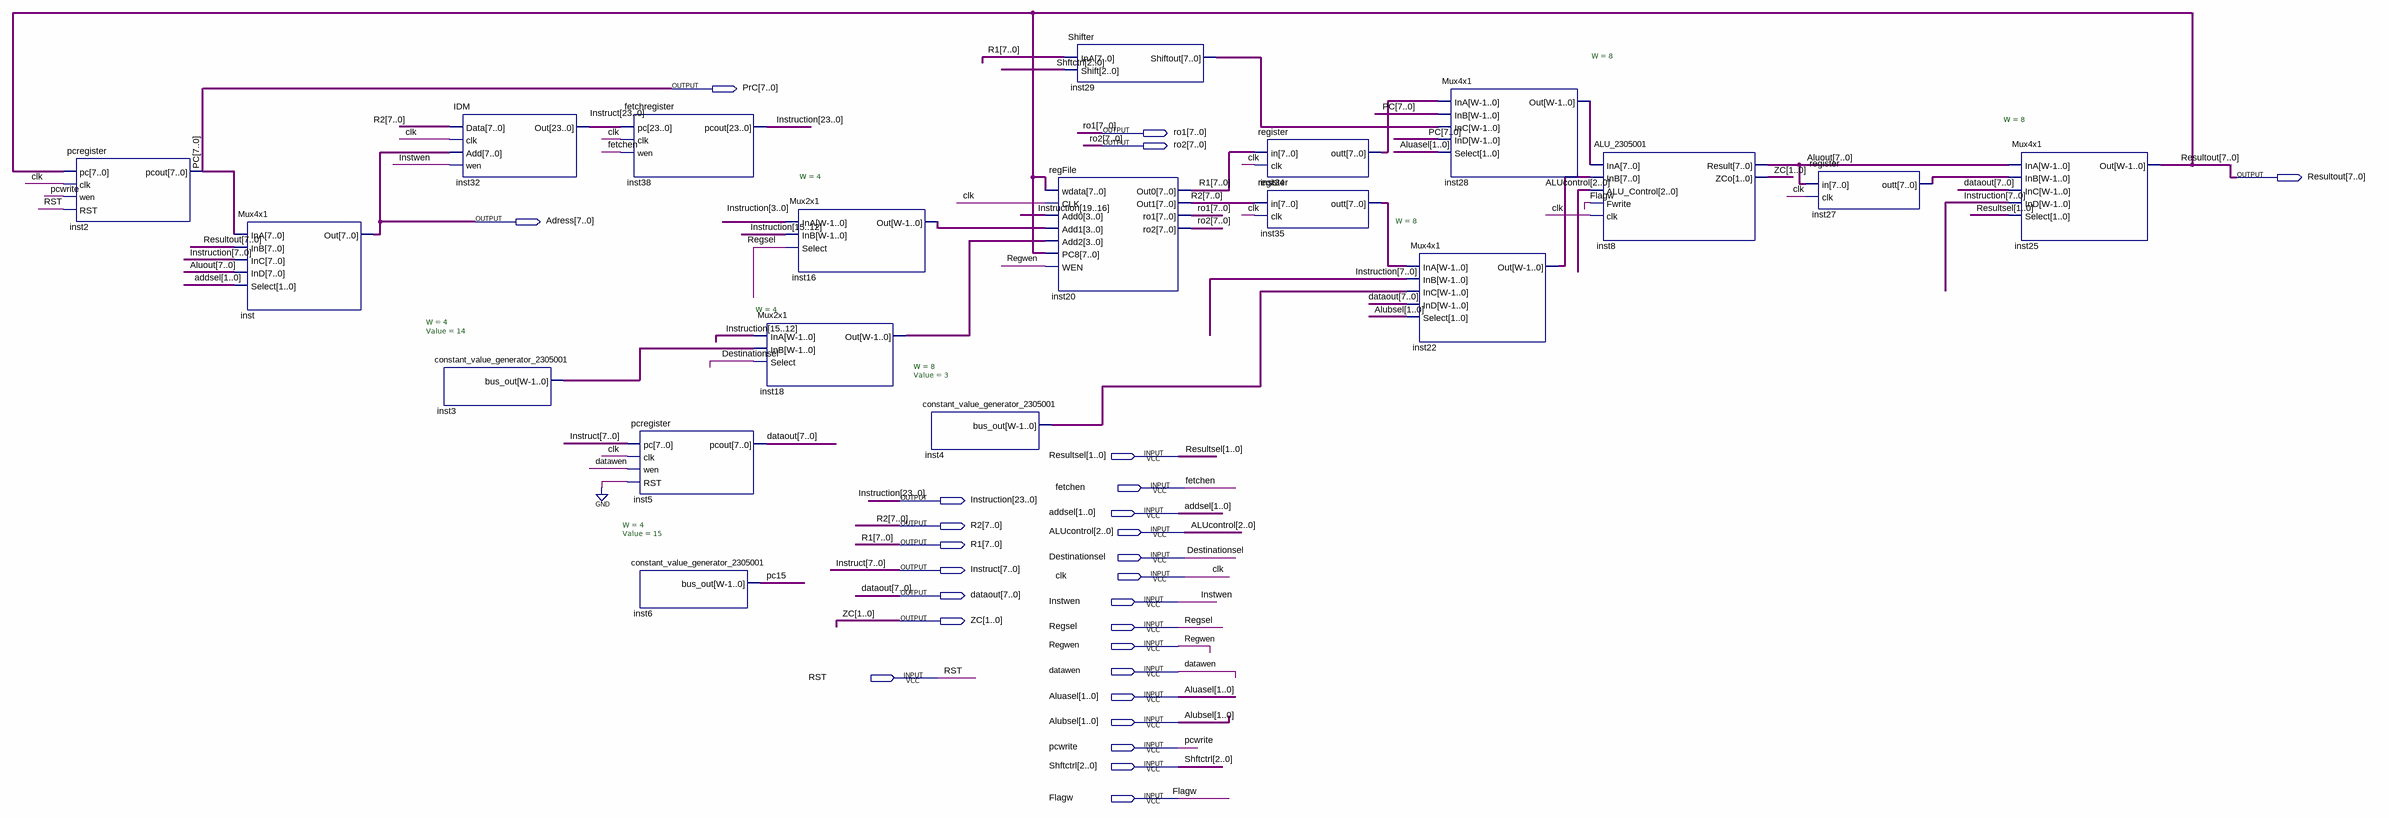
[diagram p0: schematic sheet]
// Quartus schematic Datapath.bdf as structural Verilog: 19 symbols, 27 pins
module Datapath (
  input  [1:0] Resultsel,
  input  fetchen,
  input  [1:0] addsel,
  input  [2:0] ALUcontrol,
  input  Destinationsel,
  input  clk,
  input  Instwen,
  input  Regsel,
  input  Regwen,
  input  datawen,
  input  RST,
  input  [1:0] Aluasel,
  input  [1:0] Alubsel,
  input  pcwrite,
  input  [2:0] Shftctrl,
  input  Flagw,
  output [7:0] PrC,
  output [7:0] ro1,
  output [7:0] ro2,
  output [7:0] Resultout,
  output [7:0] Adress,
  output [23:0] Instruction,
  output [7:0] R2,
  output [7:0] R1,
  output [23:0] Instruct,
  output [7:0] dataout,
  output [1:0] ZC
);

  wire pc15;
  wire [3:0] inst3_bus_out, inst16_out, inst18_out;
  wire [7:0] Aluout, inst4_bus_out, inst22_out, inst27_outt, inst28_out, inst29_shiftout, inst34_outt,
       inst35_outt;

  pcregister inst2 (.pc(Resultout), .clk(clk), .wen(pcwrite), .RST(RST), .pcout(PrC));
  Mux4x1 inst (.InA(PrC), .InB(Resultout), .InC(Instruction[7:0]), .InD(Aluout), .Select(addsel), .Out(Adress));
  constant_value_generator_2305001 #(.W(4), .Value(14)) inst3 (.bus_out(inst3_bus_out));
  IDM inst32 (.Data(R2), .clk(clk), .Add(Adress), .wen(Instwen), .Out(Instruct));
  fetchregister inst38 (.pc(Instruct), .clk(clk), .wen(fetchen), .pcout(Instruction));
  pcregister inst5 (.pc(Instruct[7:0]), .clk(clk), .wen(datawen), .RST(1'b0), .pcout(dataout));
  constant_value_generator_2305001 #(.W(4), .Value(15)) inst6 (.bus_out(pc15));
  Mux2x1 #(.W(4)) inst16 (.InA(Instruction[3:0]), .InB(Instruction[15:12]), .Select(Regsel), .Out(inst16_out));
  Mux2x1 #(.W(4)) inst18 (.InA(Instruction[15:12]), .InB(inst3_bus_out), .Select(Destinationsel), .Out(inst18_out));
  constant_value_generator_2305001 #(.W(8), .Value(3)) inst4 (.bus_out(inst4_bus_out));
  regFile inst20 (
    .wdata(Resultout), .CLK(clk), .Add0(Instruction[19:16]), .Add1(inst16_out), .Add2(inst18_out),
    .PC8(Resultout), .WEN(Regwen), .Out0(R1), .Out1(R2), .ro1(ro1), .ro2(ro2));
  Shifter inst29 (.InA(R1), .Shift(Shftctrl), .Shiftout(inst29_shiftout));
  register inst34 (.in(R1), .clk(clk), .outt(inst34_outt));
  register inst35 (.in(R2), .clk(clk), .outt(inst35_outt));
  Mux4x1 #(.W(8)) inst22 (
    .InA(inst35_outt), .InB(Instruction[7:0]), .InC(inst4_bus_out), .InD(dataout), .Select(Alubsel),
    .Out(inst22_out));
  Mux4x1 #(.W(8)) inst28 (
    .InA(inst34_outt), .InB(PrC), .InC(inst29_shiftout), .InD(PrC), .Select(Aluasel), .Out(inst28_out));
  ALU_2305001 inst8 (
    .InA(inst28_out), .InB(inst22_out), .ALU_Control(ALUcontrol), .Fwrite(Flagw), .clk(clk), .Result(Aluout),
    .ZCo(ZC));
  register inst27 (.in(Aluout), .clk(clk), .outt(inst27_outt));
  Mux4x1 #(.W(8)) inst25 (
    .InA(Aluout), .InB(inst27_outt), .InC(dataout), .InD(Instruction[7:0]), .Select(Resultsel),
    .Out(Resultout));

  // Other names for the same wires on the sheet: PC[7:0] = PrC
endmodule
